# EAGLE design BreakOutBoard2 (EAGLE 5.10)
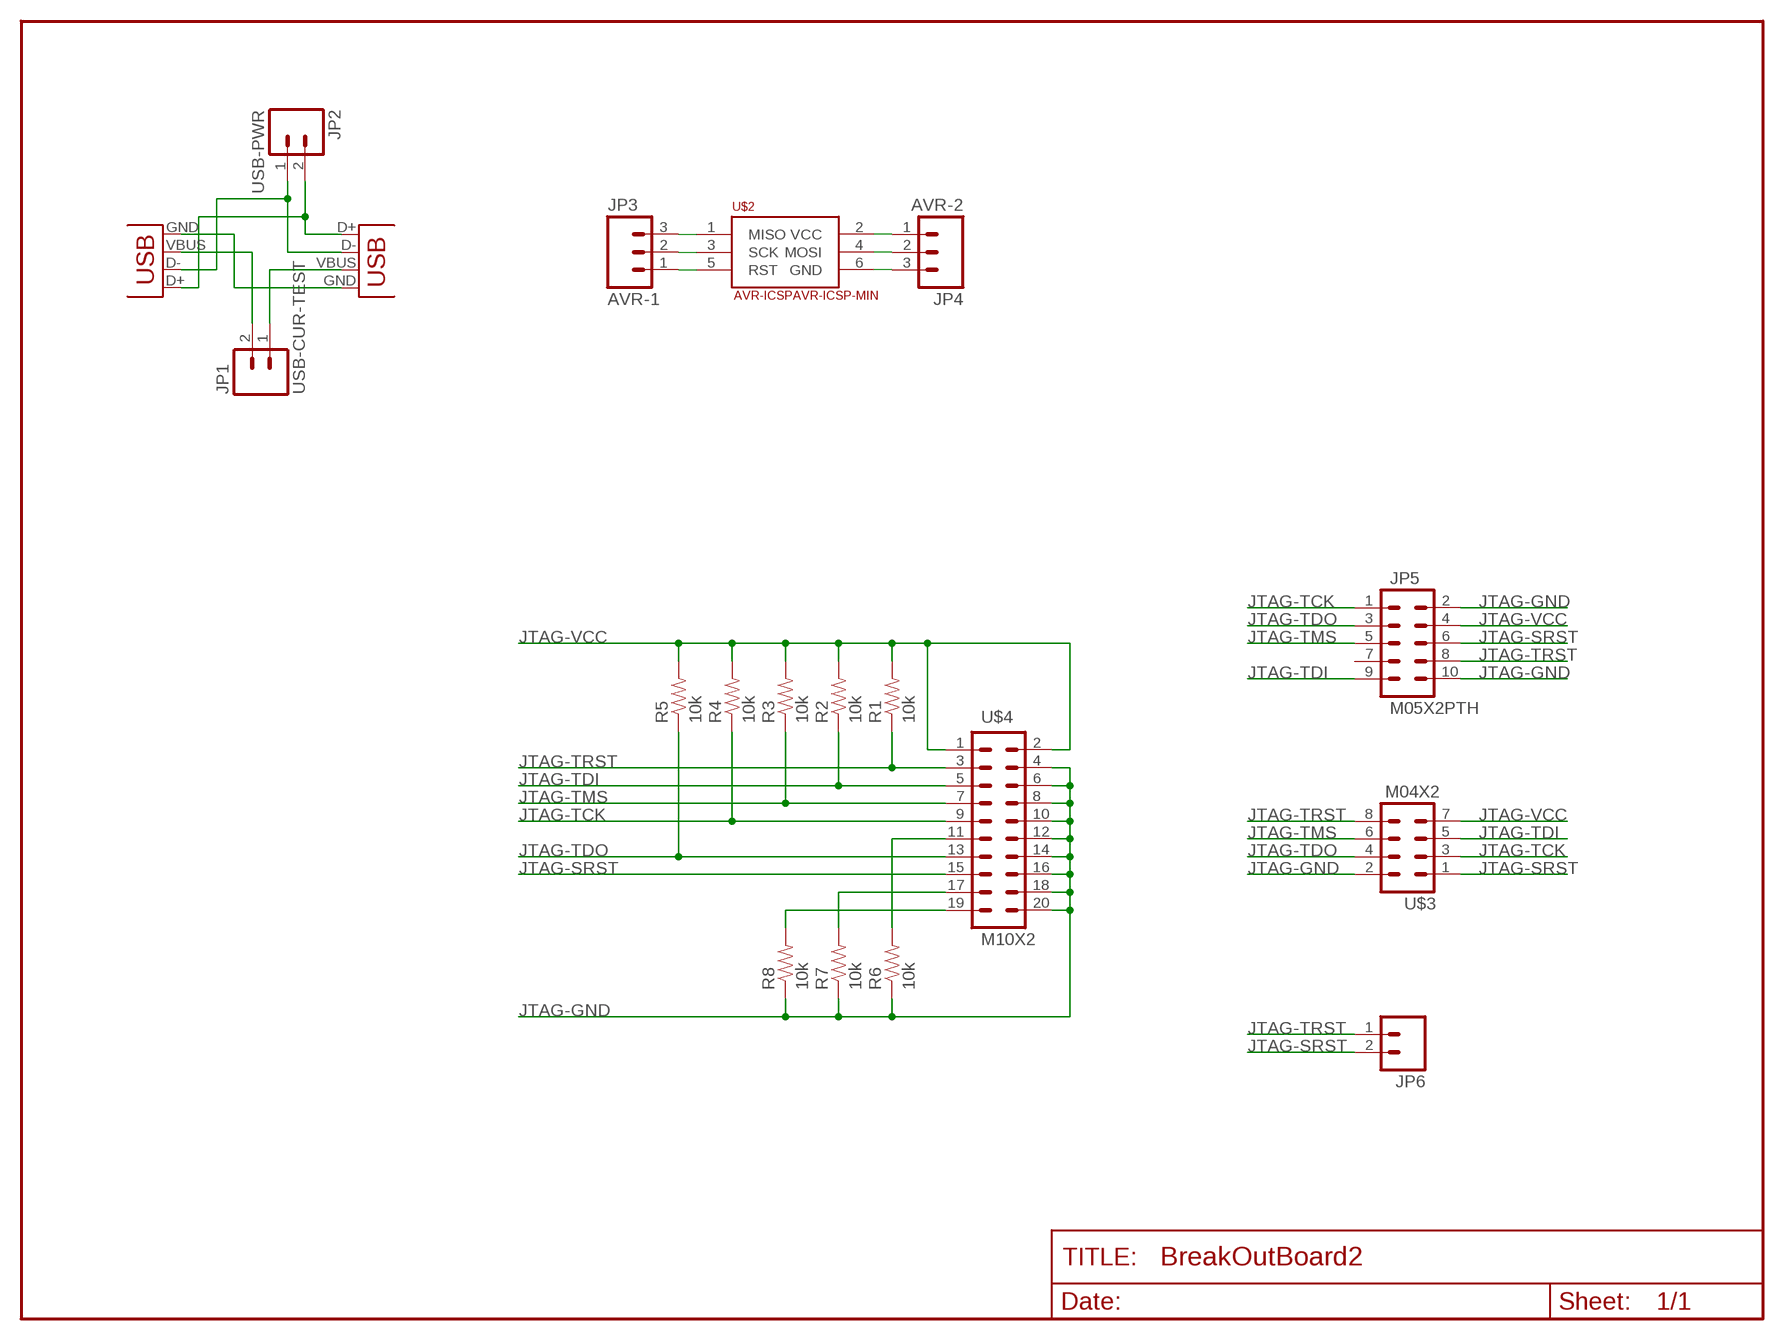
[diagram p0: schematic, sheet 1]

## Parts
JP1  USB-CUR-TEST  M02PTH  [1X02]
JP2  USB-PWR  M02PTH  [1X02]
JP3  AVR-1  M03PTH  [1X03]
JP4  AVR-2  M03PTH  [1X03]
JP5  M05X2PTH  [AVR_ICSP]
JP6  M02PTH  [1X02]
R1  10k  RESISTOR0805-RES  [0805]
R2  10k  RESISTOR0805-RES  [0805]
R3  10k  RESISTOR0805-RES  [0805]
R4  10k  RESISTOR0805-RES  [0805]
R5  10k  RESISTOR0805-RES  [0805]
R6  10k  RESISTOR0805-RES  [0805]
R7  10k  RESISTOR0805-RES  [0805]
R8  10k  RESISTOR0805-RES  [0805]
U$2  AVR-ICSPAVR-ICSP-MIN  [AVR-ICSP-MIN]
U$3  M04X2  [2X4]
U$4  M10X2  [2X10]
X1  USB-MICROB  [USB-MICROB]
X2  USB-A-SMD  [USB-A-S-NOSILK-FEMALE]

## Nets
GND: JP4.3 U$2.6(GND)
JTAG-GND: JP5.2 JP5.10 R6.1 R7.1 R8.1 U$3.2 U$4.4 U$4.6 U$4.8 U$4.10 U$4.12 U$4.14 U$4.16 U$4.18 U$4.20
JTAG-SRST: JP5.6 JP6.2 U$3.1 U$4.15
JTAG-TCK: JP5.1 R4.1 U$3.3 U$4.9
JTAG-TDI: JP5.9 R2.1 U$3.5 U$4.5
JTAG-TDO: JP5.3 R5.1 U$3.4 U$4.13
JTAG-TMS: JP5.5 R3.1 U$3.6 U$4.7
JTAG-TRST: JP5.8 JP6.1 R1.1 U$3.8 U$4.3
JTAG-VCC: JP5.4 R1.2 R2.2 R3.2 R4.2 R5.2 U$3.7 U$4.1 U$4.2
MISO: JP3.3 U$2.1(MISO)
MOSI: JP4.2 U$2.4(MOSI)
N$1: R6.2 U$4.11
N$2: R7.2 U$4.17
N$3: R8.2 U$4.19
N$4: JP1.2 X1.VBUS
N$5: JP1.1 X2.VBUS
RST: JP3.1 U$2.5(RST)
SCK: JP3.2 U$2.3(SCK)
USBDM: JP2.1 X1.D- X2.D-
USBDP: JP2.2 X1.D+ X2.D+
USBGND: X1.GND X2.GND
VCC: JP4.1 U$2.2(VCC)
Unconnected: JP5.7

## Library data of the parts
JP1 JP2 JP6 = SparkFun:M02: Header 2 Standard 2-pin 0.1" header. Use with straight break away headers (SKU : PRT-00116), right angle break away headers (PRT-00553), swiss pins (PRT-00743), machine pins (PRT-00117), and female headers (PRT-00115). Molex polarized connector foot print use with SKU : PRT-08233 with associated crimp pins and housings.
JP3 JP4 = SparkFun:M03: Header 3 Standard 3-pin 0.1" header. Use with straight break away headers (SKU : PRT-00116), right angle break away headers (PRT-00553), swiss pins (PRT-00743), machine pins (PRT-00117), and female headers (PRT-00115). Molex polarized connector foot print use with SKU : PRT-08232 with associated crimp pins and housings.
JP5 = SparkFun:M05X2: Header 5x2 Standard 10-pin dual row 0.1" header. Commonly used with AVR-ISP. Use with Spark Fun Electronics SKU: PRT-00778
R1-R8 = SparkFun:RESISTOR: Resistor Basic schematic elements and footprints for 0603, 1206, and PTH resistors.
U$2 = FiveVolt:AVR-ICSP
U$3 = SparkFun:M04X2
U$4 = SparkFun:M10X2: This was SPECIALLY designed to be used with our Graphic LCD Backpack. Be sure you want to use this! It is not only staggered on each line of header holes, but IT IS ALSO offset of the center point of the top and bottom lines by 5 mil. This causes the headers to lock into place on the "standard" footprint on the LCD screen. The extra squares on the tdocu layer are there simply to reference other pins (if you were to actually populate a longer header than ten long - this is what we do with the backpacks).
X1 X2 = SparkFun:USB: USB Connectors USB-B-PTH is fully proven SKU : PRT-00139 USB-miniB is fully proven SKU : PRT-00587 USB-A-PCB is untested. USB-A-H is throughly reviewed, but untested. Spark Fun Electronics SKU : PRT-00437 USB-B-SMT is throughly reviewed, but untested. Needs silkscreen touching up. USB-A-S has not been used/tested USB-MB-H has not been used/tested

## Board
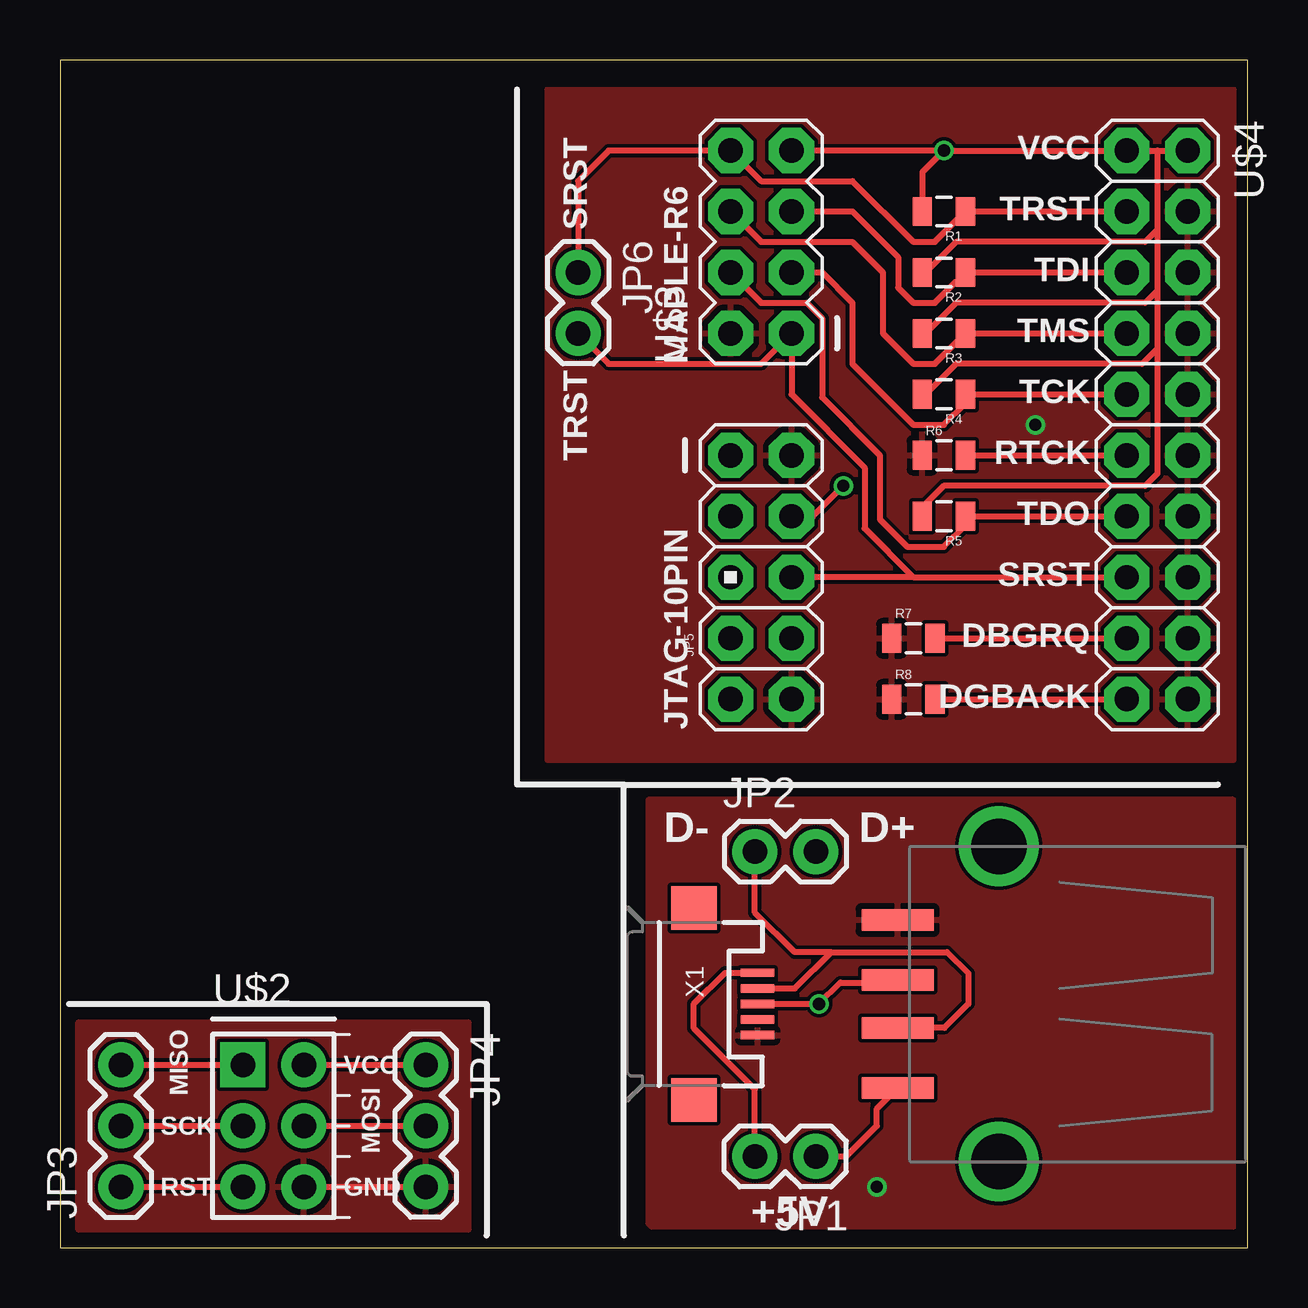
[diagram p1: board, top side]
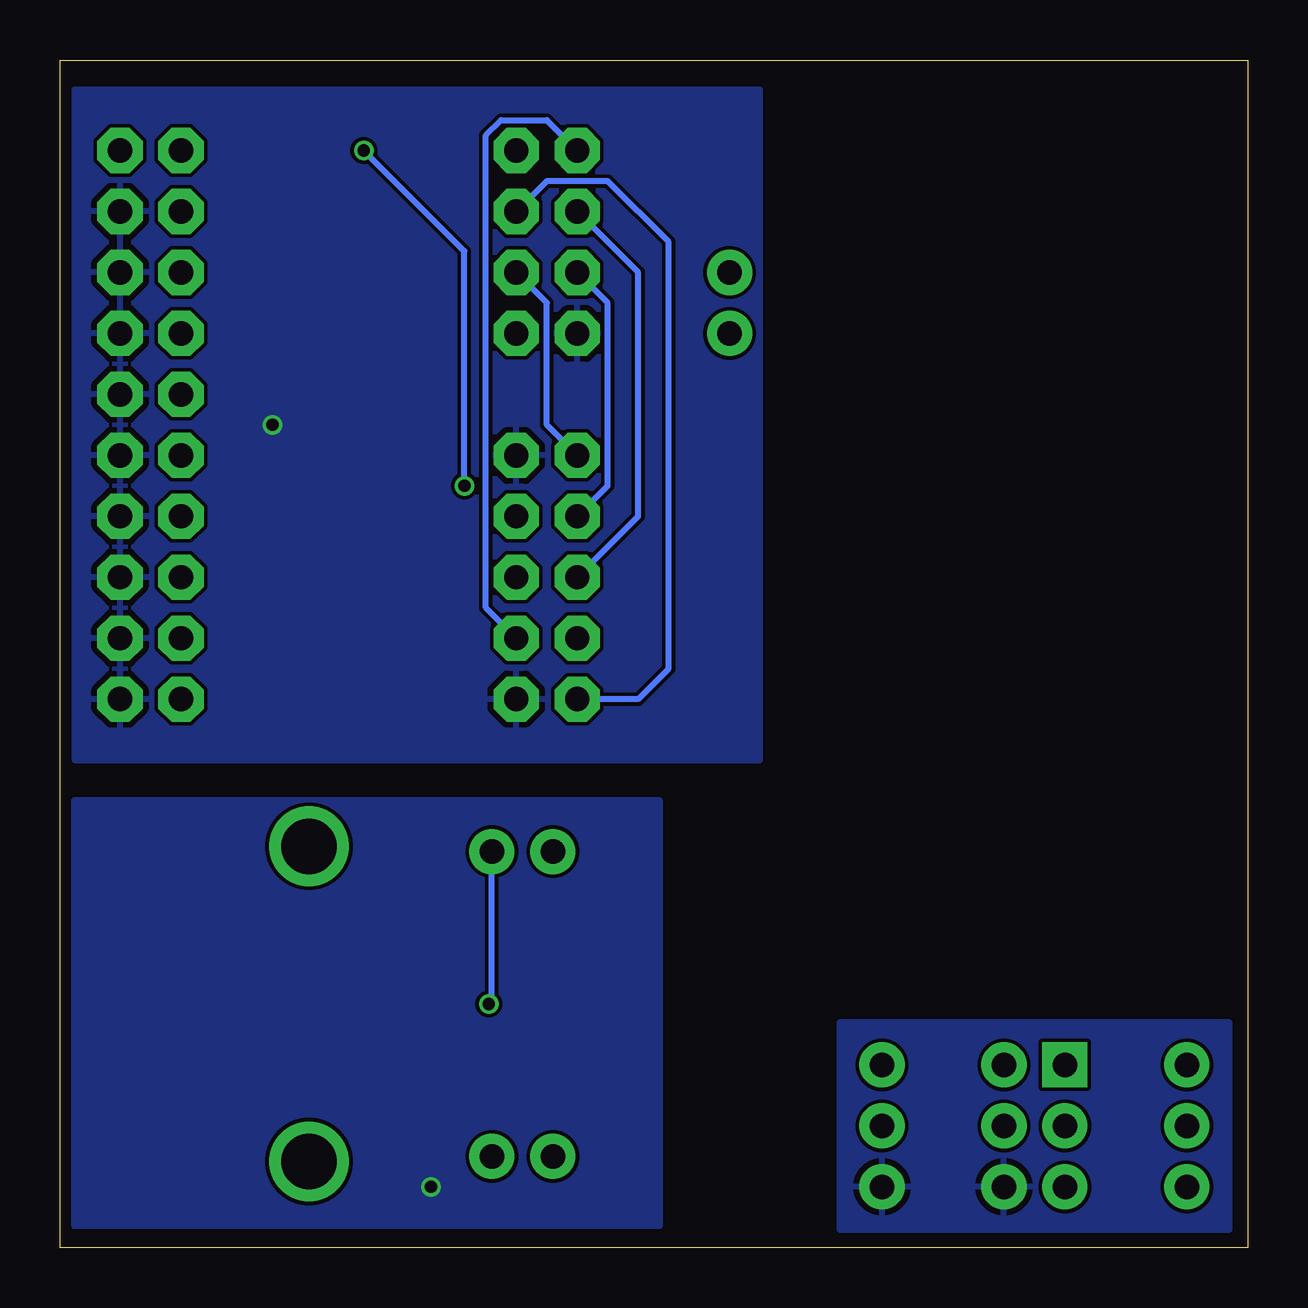
[diagram p2: board, bottom side, seen from below]

Size 49.49 x 49.49 mm. Coordinates in mm from the lower left corner, seen from the top.
Outline: 0,0 49.49,0 49.49,49.49 0,49.49 0,0
Copper layers (1*16): Top 0.035mm / dielectric 1.5mm / Bottom 0.035mm
Design rules "ITead_rule": minimum track width 6mil, minimum drill 12mil, track to track 6mil, track to pad 6mil, pad to pad 6mil, via to via 6mil, smd to smd 0mil, copper to edge 10mil, drill to drill 10mil, minimum pad ring 10mil, minimum via ring 6mil, stop-mask expansion 2mil, vias tented up to drill 100mil, thermal gap 10mil

### Footprints (pad centres in the part's own frame; a part is rotated, then mirrored left to right if it is on the bottom)
1X02 = drill 1.016 pad 1.88 round: 1 0,0; 2 2.54,0
1X03 = drill 1.016 pad 1.88 round: 1 0,0; 2 2.54,0; 3 5.08,0
AVR_ICSP = drill 1.016 pad 1.88 octagon: 1 -1.27,5.08; 2 1.27,5.08; 3 -1.27,2.54; 4 1.27,2.54; 5 -1.27,0; 6 1.27,0; 7 -1.27,-2.54; 8 1.27,-2.54; 9 -1.27,-5.08; 10 1.27,-5.08
0805 = smd 0.8 x 1.2: 1 -0.9,0; 2 0.9,0
AVR-ICSP-MIN = drill 1.016 pad 1.88 square: 1 -1.27,2.54 | drill 1.016 pad 1.88 round: 2 1.27,2.54; 3 -1.27,0; 4 1.27,0; 5 -1.27,-2.54; 6 1.27,-2.54
2X4 = drill 1.016 pad 1.88 octagon: 1 -3.81,-1.27; 2 -3.81,1.27; 3 -1.27,-1.27; 4 -1.27,1.27; 5 1.27,-1.27; 6 1.27,1.27; 7 3.81,-1.27; 8 3.81,1.27
2X10 = drill 1.016 pad 1.88 octagon: 1 -11.43,-1.27; 2 -11.43,1.27; 3 -8.89,-1.27; 4 -8.89,1.27; 5 -6.35,-1.27; 6 -6.35,1.27; 7 -3.81,-1.27; 8 -3.81,1.27; 9 -1.27,-1.27; 10 -1.27,1.27; 11 1.27,-1.27; 12 1.27,1.27; 13 3.81,-1.27; 14 3.81,1.27; 15 6.35,-1.27; 16 6.35,1.27; 17 8.89,-1.27; 18 8.89,1.27; 19 11.43,-1.27; 20 11.43,1.27
USB-MICROB = smd 0.35 x 1.4: D+ 0,2.65; D- -0.65,2.65; GND 1.3,2.65; ID 0.65,2.65; VBUS -1.3,2.65 | smd 1.8 x 1.9: MT1 -4,0; MT2 4,0
USB-A-S-NOSILK-FEMALE = smd 3 x 0.9: D+ 4.212,-1; D- 4.212,1; GND 4.212,-3.5; VBUS 4.212,3.5 | drill 2.311 round: P$5 0,-6.566; P$6 0,6.566

### Placement (x,y rotation side)
JP1  31.5,3.81 180 top
JP2  28.96,16.51 0 top
JP3  2.54,2.54 90 top
JP4  15.24,7.62 270 top
JP5  29.21,27.94 0 top
JP6  21.59,40.64 270 top
R1  36.83,43.18 180 top
R2  36.83,40.64 180 top
R3  36.83,38.1 180 top
R4  36.83,35.56 180 top
R5  36.83,30.48 180 top
R6  36.83,33.02 0 top
R7  35.56,25.4 0 top
R8  35.56,22.86 0 top
U$2  8.89,5.08 0 top
U$3  29.21,41.91 90 top
U$4  45.72,34.29 270 top
X1  26.42,10.16 270 top
X2  39.12,10.16 180 top

### Tracks (layer width: path | path; a pad name or v marks a point on that pad's centre or on a via)
GND
  Top 0.254: U$2.6 JP4.3
  pour Top: 0.76,9.4 17.02,9.4 17.02,0.76 0.76,0.76
  pour Bottom: 0.76,9.4 17.02,9.4 17.02,0.76 0.76,0.76
JTAG-GND  (via drill 0.51)
  other vias: 40.64,34.29
  pour Top: 48.9,48.26 48.9,20.32 20.32,20.32 20.32,48.26
  pour Bottom: 20.32,48.26 48.9,48.26 48.9,20.32 20.32,20.32
JTAG-SRST
  Top 0.254: JP6.2 22.86,36.83 29.21,36.83 U$3.1 30.48,35.56 33.53,32.51 33.53,29.97 35.56,27.94 | 35.56,27.94 JP5.6 | 35.56,27.94 U$4.15
JTAG-TCK
  Top 0.254: U$4.9 R4.1 37.73,35.19 36.83,34.29 35.56,34.29 33.02,36.83 33.02,39.37 31.75,40.64 U$3.3
  Bottom 0.254: JP5.1 29.21,34.29 29.21,39.37 U$3.3
JTAG-TDI
  Top 0.254: U$4.5 R2.1 37.73,40.27 37.35,40.27 36.45,39.37 35.56,39.37 34.92,40.01 34.92,41.27 33.02,43.18 U$3.5
  Bottom 0.254: JP5.9 25.4,22.86 24.13,24.13 24.13,41.91 26.67,44.45 29.21,44.45 U$3.5
JTAG-TDO
  Top 0.254: U$4.13 R5.1 37.73,30.11 36.83,29.21 35.31,29.21 34.16,30.35 34.16,33.02 31.75,35.43 31.75,38.73 31.11,39.37 29.21,39.37 U$3.4
  Bottom 0.254: JP5.3 26.67,31.75 26.67,39.37 U$3.4
JTAG-TMS
  Top 0.254: R3.1 U$4.7 | R3.1 37.73,37.73 | R3.1 36.45,36.83 35.56,36.83 34.29,38.1 34.29,40.64 33.02,41.91 29.21,41.91 U$3.6
  Bottom 0.254: JP5.5 25.4,30.48 25.4,40.64 U$3.6
JTAG-TRST
  Top 0.254: U$4.3 R1.1 36.45,41.91 35.56,41.91 33.02,44.45 29.21,44.45 U$3.8 22.86,45.72 21.59,44.45 JP6.1
  Bottom 0.254: JP5.8 31.75,26.67 31.75,46.35 31.11,46.99 29.21,46.99 U$3.8
JTAG-VCC  (via drill 0.51)
  Top 0.254: 45.72,45.72 U$4.1 v36.83,45.72 | 45.72,45.72 U$4.2 | R1.2 35.93,44.82 v36.83,45.72 | v36.83,45.72 U$3.7 | R3.2 36.07,38.1 37.34,39.37 45.21,39.37 45.72,39.88 | 45.72,42.42 45.72,39.88 | 45.72,45.72 45.72,42.42 | R4.2 36.07,35.56 37.34,36.83 45.09,36.83 45.72,37.47 | 45.72,39.88 45.72,37.47 | R5.2 35.93,30.85 36.83,31.75 45.21,31.75 45.72,32.26 45.72,37.47 | R2.2 36.07,40.64 37.34,41.91 45.21,41.91 45.72,42.42 | JP5.4 31.37,30.48 v32.64,31.75
  Bottom 0.254: v32.64,31.75 32.64,41.53 v36.83,45.72
MISO
  Top 0.254: JP3.3 U$2.1
MOSI
  Top 0.254: U$2.4 JP4.2
N$1
  Top 0.254: R6.2 U$4.11
N$2
  Top 0.254: R7.2 U$4.17
N$3
  Top 0.254: R8.2 U$4.19
N$4
  Top 0.254: X1.VBUS 27.72,11.46 26.42,10.16 26.42,9.14 28.96,6.6 JP1.2
N$5
  Top 0.254: JP1.1 32.77,3.81 34.04,5.08 34.04,5.79 X2.VBUS
RST
  Top 0.254: JP3.1 U$2.5
SCK
  Top 0.254: JP3.2 U$2.3
USBDM
  Top 0.254: X2.D- 36.85,9.16 37.85,10.16 37.85,11.43 36.96,12.32 32.13,12.32 | X1.D- 30.62,10.81 32.13,12.32 | 32.13,12.32 30.61,12.32 28.96,13.97 JP2.1
USBDP  (via drill 0.51)
  Top 0.254: X1.D+ v31.62,10.16 32.51,11.05 34.79,11.05 X2.D+
  Bottom 0.254: JP2.2 31.5,10.29 v31.62,10.16
USBGND  (via drill 0.51)
  other vias: 34.04,2.54
  pour Top: 24.51,18.67 24.51,1.02 24.64,0.89 48.9,0.89 48.9,18.67
  pour Bottom: 24.51,18.67 24.51,0.89 48.9,0.89 48.9,18.67
VCC
  Top 0.254: U$2.2 JP4.1

### Text on the board
tPlace: VCC | TRST | SRST | TDI | TMS | TRST | MAPLE-R6 | TCK | RTCK | TDO | SRST | DBGRQ | DGBACK | JTAG-10PIN | D- | D+ | VCC | MISO | SCK | MOSI | RST | GND | +5V